# EAGLE design Pure SH (EAGLE 9.6.2)
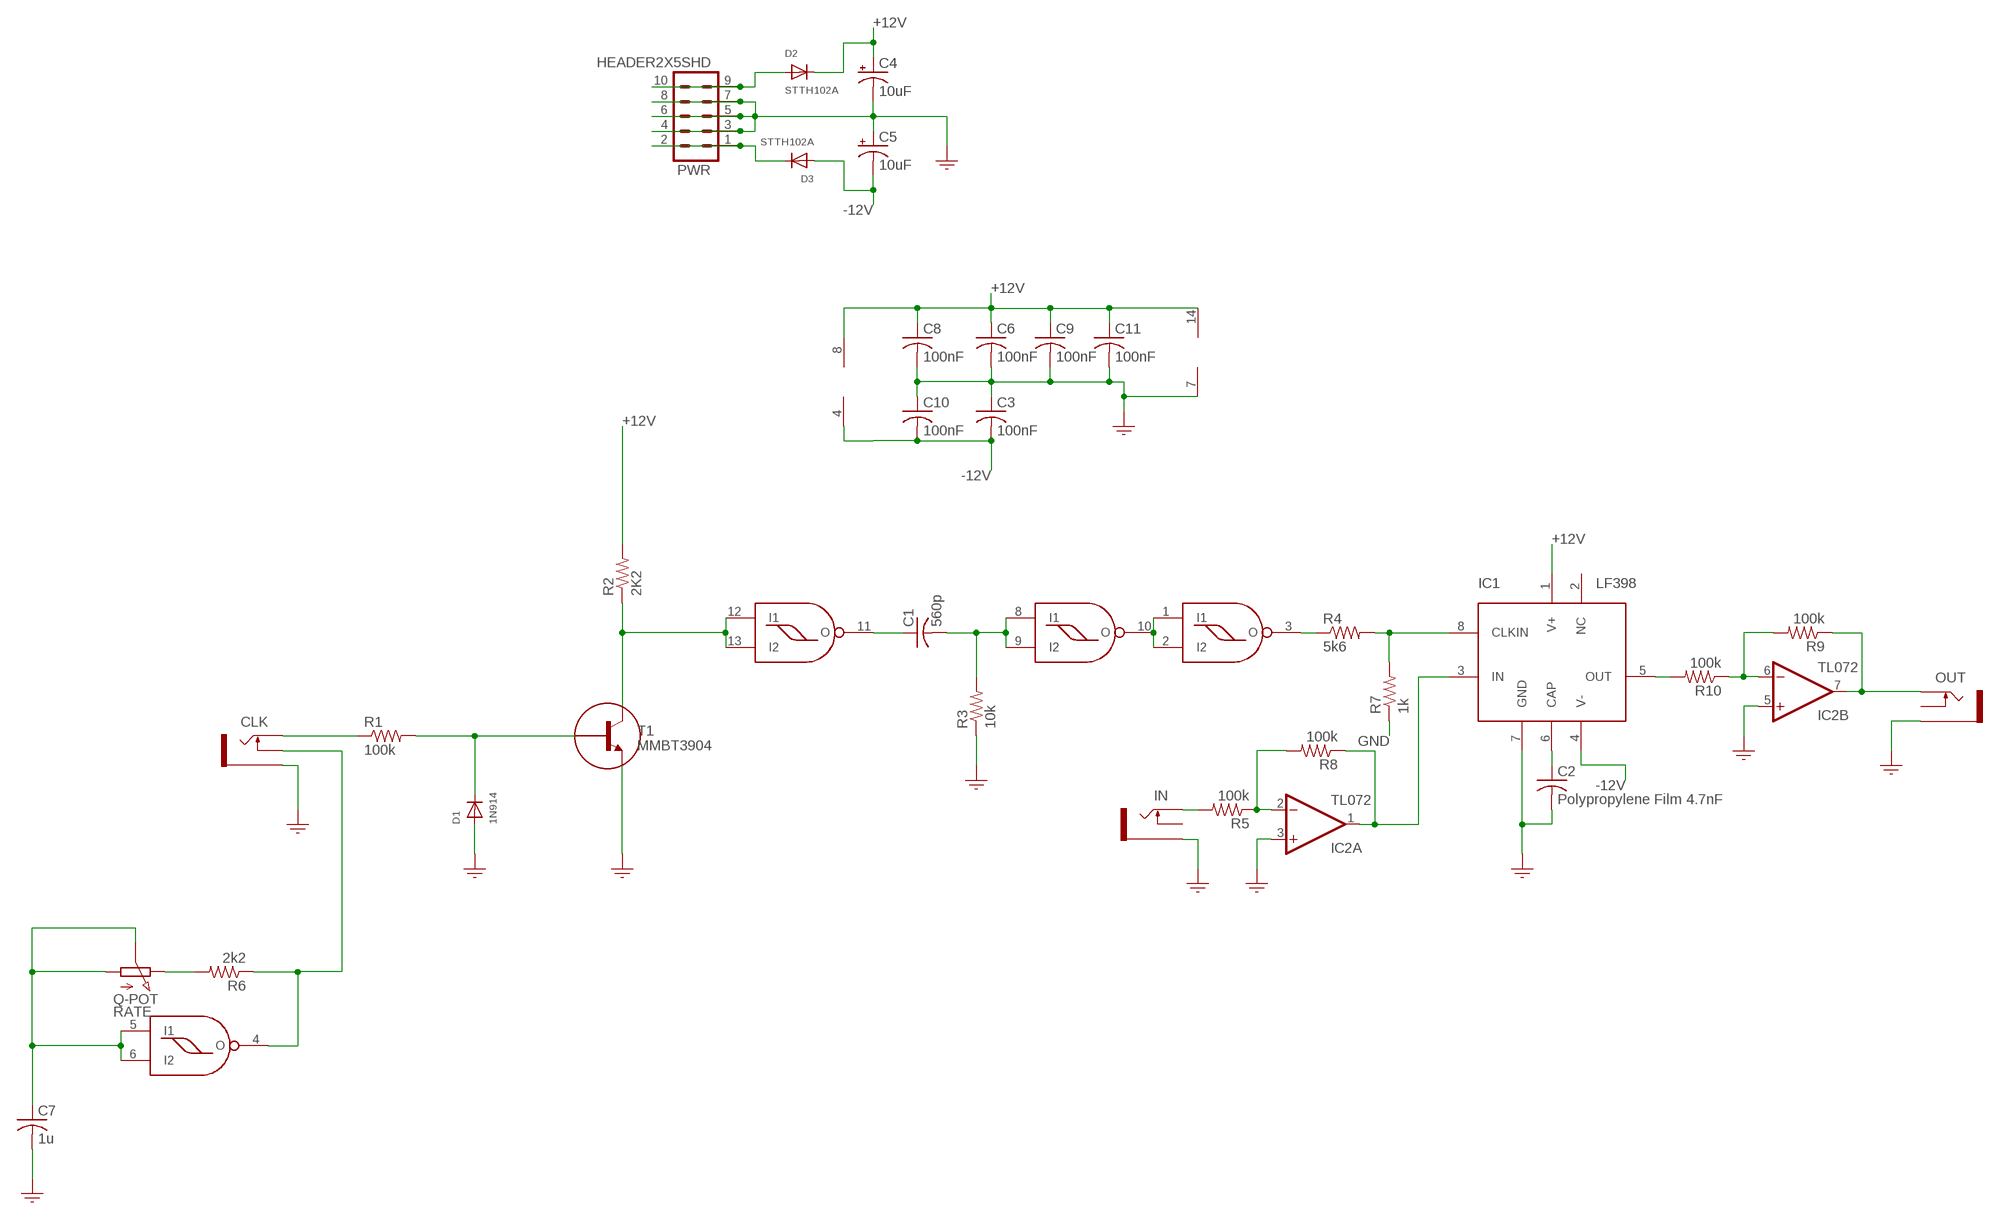
[diagram p0: schematic, sheet 1]

## Parts
C1  560p  CAPACITOR-USC0805  [C0805]
C2  Polypropylene Film 4.7nF  CAPACITOR-USC050-045X075  [C050-045X075]
C3  100nF  CAPACITOR-USC0805  [C0805]
C4  10uF  CAPACITOR_POL-US153CLV-0505  [153CLV-0505]
C5  10uF  CAPACITOR_POL-US153CLV-0505  [153CLV-0505]
C6  100nF  CAPACITOR-USC0805  [C0805]
C7  1u  CAPACITOR-USC0805  [C0805]
C8  100nF  CAPACITOR-USC0805  [C0805]
C9  100nF  CAPACITOR-USC0805  [C0805]
C10  100nF  CAPACITOR-USC0805  [C0805]
C11  100nF  CAPACITOR-USC0805  [C0805]
CLK  PJ301M-12  SOCKET_MONO_3.5MMPJ301M-12  [PJ301M-12]
D1  1N914  DIODEDO-41  [DO-41]
D2  STTH102A  DIODESMA  [SMADIODE]
D3  STTH102A  DIODESMA  [SMADIODE]
IC1  LF398  SAMPLE_HOLD_LF398  [SOIC--8]
IC2  TL072  OPAMP_DUALD  [SO08]
IC3  cd4093  SCHMITT_TRIG_QUAD  [SOIC14]
IN  PJ301M-12  SOCKET_MONO_3.5MMPJ301M-12  [PJ301M-12]
OUT  PJ301M-12  SOCKET_MONO_3.5MMPJ301M-12  [PJ301M-12]
PWR  HEADER2X5SHD  [2X5-SHROUDED]
R1  100k  RESISTOR_USR0805  [R0805]
R2  2K2  RESISTOR_USR0805  [R0805]
R3  10k  RESISTOR_USR0805  [R0805]
R4  5k6  RESISTOR_USR0805  [R0805]
R5  100k  RESISTOR_USR0805  [R0805]
R6  2k2  RESISTOR_USR0805  [R0805]
R7  1k  RESISTOR_USR0805  [R0805]
R8  100k  RESISTOR_USR0805  [R0805]
R9  100k  RESISTOR_USR0805  [R0805]
R10  100k  RESISTOR_USR0805  [R0805]
RATE  Q-POT  RESISTOR_VARIABLE9MM_POT  [POTENTIOMETER_9MM]
T1  MMBT3904  TRANSISTOR_NPNSOT23  [SOT23]

## Nets
+12V: C4.+ C6.1 C8.1 C9.1 C11.1 D2.C IC1.1(V+) IC2.8(P:V+) IC3.14(V+) R2.2
-12V: C3.2 C5.- C10.2 D3.A IC1.4(V-) IC2.4(P:V-)
GND: C2.2 C3.1 C4.- C5.+ C6.2 C7.2 C8.2 C9.2 C10.1 C11.2 CLK.GND(SLEEVE) D1.A IC1.7(GND) IC2.3(A:+IN) IC2.5(B:+IN) IC3.7(V-) IN.GND(SLEEVE) OUT.GND(SLEEVE) PWR.3 PWR.4 PWR.5 PWR.6 PWR.7 PWR.8 R3.1 R7.1 T1.2(E)
N$1: CLK.TIP R1.1
N$2: D1.C R1.2 T1.1(B)
N$3: C1.1 IC3.11(O)
N$4: IC3.12(I1) IC3.13(I2) R2.1 T1.3(C)
N$5: IC3.1(I1) IC3.2(I2) IC3.10(O)
N$6: IC1.8(CLKIN) R4.2 R7.2
N$7: C1.2 IC3.8(I1) IC3.9(I2) R3.2
N$9: IC3.3(O) R4.1
N$10: C2.1 IC1.6(CAP)
N$11: IN.TIP R5.2
N$12: IC2.2(A:-IN) R5.1 R8.2
N$13: R6.2 RATE.P$3
N$14: C7.1 IC3.5(I1) IC3.6(I2) RATE.P$1 RATE.P$2
N$15: CLK.NORM(SWITCH) IC3.4(O) R6.1
N$16: IC1.3(IN) IC2.1(A:OUT) R8.1
N$17: IC1.5(OUT) R10.2
N$18: IC2.6(B:-IN) R9.2 R10.1
N$19: IC2.7(B:OUT) OUT.TIP R9.1
N$38: D2.A PWR.9 PWR.10
N$50: D3.C PWR.1 PWR.2
Unconnected: IC1.2(NC) IN.NORM(SWITCH) OUT.NORM(SWITCH)

## Library data of the parts
C1 C3 C6-C11 = GMSN:CAPACITOR-US: Capacitor; SORT: 3
C2 = GMSN:CAPACITOR-US: Capacitor; SORT: 5
C4 C5 = GMSN:CAPACITOR_POL-US: Electro Capacitor; SORT: 3
CLK IN OUT = GMSN:SOCKET_MONO_3.5MM: 3.5 mm Jack Socket; SORT: 8
D1 = GMSN:DIODE: Diode SMADIODE - SMA Surface Mount Package 20V 1A Schottky Diode Digikey: 641-1014-6-ND DO-1N4148 - Through Hole Small Current Diode SOD-123 20V 1 A (.5mV Vf) Schottky Diode - Digikey: MBRX120TPMSCT-ND SOD-323 10V 570mA (.38mV Vf, 3ns) Schottky Diode - Digikey: ZLLS410CT-ND SOD-523 30V 30mA Schottky Diode (RB751S-40TE61) - Digikey: RB751S-40TE61CT-ND SOT23-R/W - SOT23 Package (R = Solder Paste/Reflow Ovens, W = Hand-Soldering) BAT54Film 40V 300mA - Digikey: 497-7162-1-ND; SORT: 1
D2 D3 = GMSN:DIODE: Diode SMADIODE - SMA Surface Mount Package 20V 1A Schottky Diode Digikey: 641-1014-6-ND DO-1N4148 - Through Hole Small Current Diode SOD-123 20V 1 A (.5mV Vf) Schottky Diode - Digikey: MBRX120TPMSCT-ND SOD-323 10V 570mA (.38mV Vf, 3ns) Schottky Diode - Digikey: ZLLS410CT-ND SOD-523 30V 30mA Schottky Diode (RB751S-40TE61) - Digikey: RB751S-40TE61CT-ND SOT23-R/W - SOT23 Package (R = Solder Paste/Reflow Ovens, W = Hand-Soldering) BAT54Film 40V 300mA - Digikey: 497-7162-1-ND; SORT: 3.9
IC1 = GMSN:SAMPLE_HOLD_LF398: Sample and Hold; SORT: 4
IC2 = GMSN:OPAMP_DUAL: Dual Op Amp; SORT: 4.5
IC3 = GMSN:SCHMITT_TRIG_QUAD: Quad 2-input NAND schmitt trigger; SORT: 4
PWR = GMSN:HEADER2X5: Header 5x2 Standard 10-pin dual row 0.1" header. Commonly used with AVR-ISP. Use with Spark Fun Electronics SKU: PRT-00778; SORT: 7
R1-R10 = GMSN:RESISTOR_US: Resistor; SORT: 2
RATE = GMSN:RESISTOR_VARIABLE: Pot; SORT: 8
T1 = GMSN:TRANSISTOR_NPN: Generic NPN BJT MMBT2222A - TRANS-08049 (SOT-23, 1A 40V) MPSA42 - TRANS-09116 (SOT-23, 500mA 300V) MMBT5088LT1G - TRANS-11160 (SOT-23, 50 mA 30V); SORT: 4

## Board
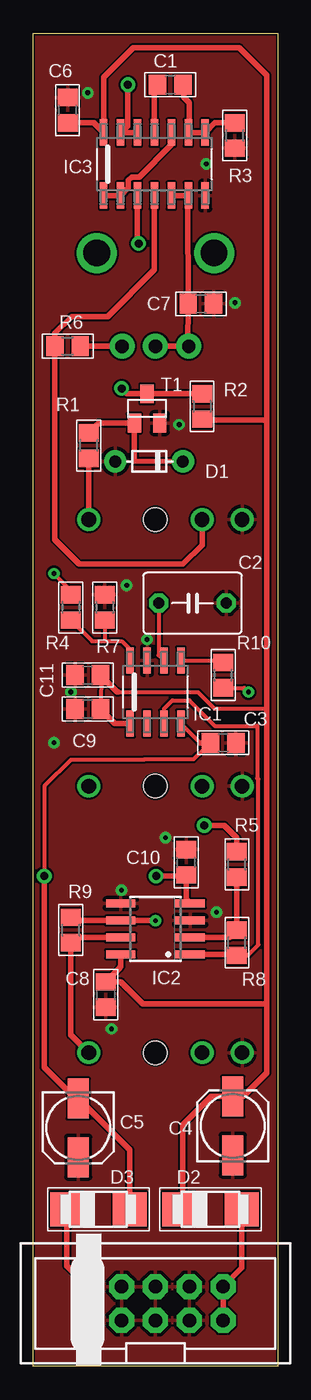
[diagram p1: board, top side]
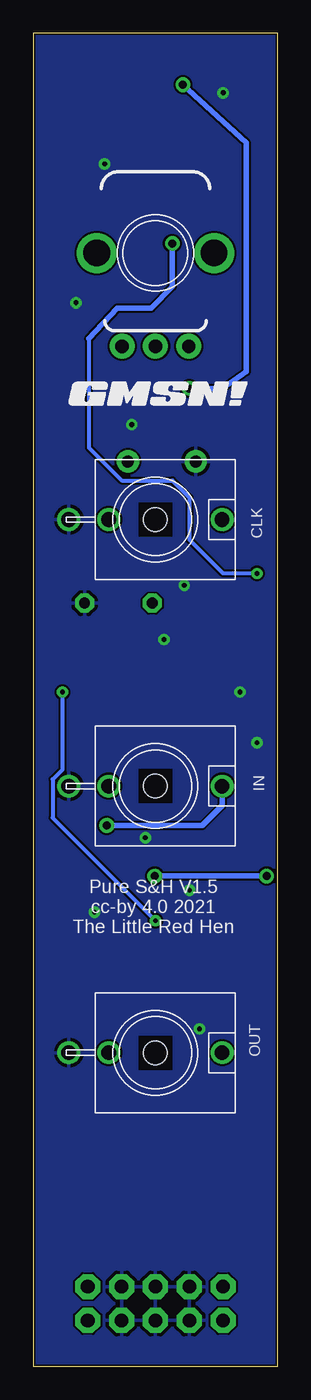
[diagram p2: board, bottom side, seen from below]

Size 18.32 x 100 mm. Coordinates in mm from the lower left corner, seen from the top.
Outline: 18.32,0 0,0 0,100 18.32,100 18.32,0
Copper layers (1*16): Top 0.035mm / dielectric 1.5mm / Bottom 0.035mm
Design rules "PCBWay": minimum track width 6mil, minimum drill 12mil, track to track 6mil, track to pad 6mil, pad to pad 6mil, via to via 6mil, smd to smd 6mil, copper to edge 6mil, drill to drill 6mil, minimum pad ring 12mil, minimum via ring 10mil, stop-mask expansion 4mil, vias tented up to drill 25mil, thermal gap 10mil

### Footprints (pad centres in the part's own frame; a part is rotated, then mirrored left to right if it is on the bottom)
C0805 = smd 1.3 x 1.5: 1 -0.95,0; 2 0.95,0
C050-045X075 = drill 0.813 octagon: 1 -2.54,0; 2 2.54,0
153CLV-0505 = smd 3 x 1.6: + 2.2,0; - -2.2,0
PJ301M-12 = drill 1.1: GND 0,-6.5; NORM 0,-3.5; TIP 0,5 | hole 1.778: 0,0
DO-41 = drill 0.9 pad 1.676: A -2.54,0; C 2.54,0
SMADIODE = smd 2.54 x 2.54: A 2.349,0; C -2.349,0
SOIC--8 = smd 1.981 x 0.559: 1 -2.362,1.905; 2 -2.362,0.635; 3 -2.362,-0.635; 4 -2.362,-1.905; 5 2.362,-1.905; 6 2.362,-0.635; 7 2.362,0.635; 8 2.362,1.905
SO08 = smd 0.6 x 2.2: 1 -1.905,-2.6; 2 -0.635,-2.6; 3 0.635,-2.6; 4 1.905,-2.6; 5 1.905,2.6; 6 0.635,2.6; 7 -0.635,2.6; 8 -1.905,2.6
SOIC14 = smd 1.981 x 0.559: 1 -2.362,3.81; 2 -2.362,2.54; 3 -2.362,1.27; 4 -2.362,0; 5 -2.362,-1.27; 6 -2.362,-2.54; 7 -2.362,-3.81; 8 2.362,-3.81; 9 2.362,-2.54; 10 2.362,-1.27; 11 2.362,0; 12 2.362,1.27; 13 2.362,2.54; 14 2.362,3.81
2X5-SHROUDED = drill 1.016 pad 1.88 octagon: 1 -1.27,5.08; 2 1.27,5.08; 3 -1.27,2.54; 4 1.27,2.54; 5 -1.27,0; 6 1.27,0; 7 -1.27,-2.54; 8 1.27,-2.54; 9 -1.27,-5.08; 10 1.27,-5.08
R0805 = smd 1.3 x 1.5: 1 -0.95,0; 2 0.95,0
POTENTIOMETER_9MM = drill 1 pad 1.88: P$1 -2.5,-7; P$2 0,-7; P$3 2.5,-7 | drill 2 pad 2.68: P$4 -4.4,0; P$5 4.4,0
SOT23 = smd 1 x 1.4: 1 -0.95,-1.1; 2 0.95,-1.1; 3 0,1.1

### Placement (x,y rotation side)
C1  10.27,96.14 0 top
C2  11.94,57.25 0 top
C3  14.24,46.77 180 top
C4  14.95,18.04 90 top
C5  3.37,17.88 270 top
C6  2.57,94.24 90 top
C7  12.57,79.71 0 top
C8  5.43,27.88 270 top
C9  4.08,49.31 180 top
C10  11.46,37.8 270 top
C11  4.08,51.85 180 top
CLK  9.16,63.52 270 bottom
D1  8.68,67.88 0 top
D2  13.29,11.77 0 top
D3  4.87,11.77 0 top
IC1  9.16,50.58 90 top
IC2  9.16,32.8 90 top
IC3  9.08,90.19 90 top
IN  9.16,43.52 270 bottom
OUT  9.16,23.52 270 bottom
PWR  9.16,4.7 90 top
R1  4.16,69.07 90 top
R2  12.65,72.01 270 top
R3  15.11,92.33 90 top
R4  2.81,56.93 270 top
R5  15.27,37.64 90 top
R6  2.57,76.54 0 top
R7  5.35,56.93 270 top
R8  15.27,31.77 90 top
R9  2.81,32.72 90 top
R10  14.24,51.85 90 top
RATE  9.16,83.52 0 bottom
T1  8.53,71.85 0 top
U$3  [GMSN!_LOGO]  8.68,72.88 0 bottom

### Tracks (layer width: path | path; a pad name or v marks a point on that pad's centre or on a via)
+12V
  Top 0.305: C11.1 5.08,51.21 C9.1 | 17.49,49.31 13.61,49.31 12.34,50.58 6.35,50.58
  Top 0.406: D2.C 11.22,11.8 11.22,18.12 13.34,20.24 C4.+ 15.73,20.24 17.49,22 17.49,26.77 17.49,27.24 | 17.49,27.24 17.49,49.31 17.49,70.82 | 17.49,27.24 17.41,27.16 8.21,27.16 6.54,28.83 C8.1 6.48,29.88 6.48,29.93 6.56,30.01 IC2.8 | R2.2 12.65,70.98 17.34,70.98 17.49,70.82 | 17.49,70.82 17.49,96.86 15.43,98.92 7.49,98.92 5.27,96.7 IC3.14 4.54,93.29 C6.1 | C11.1 6.3,50.58 6.35,50.58 | C9.1 6.12,48.22 IC1.1
-12V  (via drill 0.6)
  Top 0.305: C3.2 12,45.53 8.33,45.53 8.3,45.5 2.81,45.5 0.83,43.52 v0.83,36.77 | 12.51,46.77 IC1.4
  Top 0.406: D3.A 7.22,16.22 C5.- 3.15,20.08 0.83,22.4 v0.83,36.77 | C3.2 12.51,46.77 | v9.21,36.77 11.43,36.77 C10.2 11.46,35 IC2.4
  Bottom 0.406: v0.83,36.77 v9.21,36.77
GND  (via drill 0.35)
  other vias: 1.54,46.77 2.81,50.58 8.53,54.52 9.92,39.66 13.73,34.07 6.62,35.72 5.86,25.31 7,58.58 10.94,70.65 15.13,79.79 4.08,95.54 12.97,90.2
  pour Bottom: 18.32,100 0,100 0,0 18.32,0
  pour Top: 18.32,100 0,100 0,0 18.32,0
N$1
  Top 0.406: R1.1 CLK.TIP
N$2
  Top 0.406: R1.2 4.89,70.75 T1.1 7.57,67.92 D1.C
N$3
  Top 0.406: IC3.11 9.08,95.9 C1.1
N$4  (via drill 0.6)
  Top 0.406: R2.1 8.53,72.96 | 8.53,72.96 T1.3 | 8.53,72.96 7.02,72.96 v6.62,73.36 | v7.1,96.14 7.1,93.76 7.1,93.03 6.62,92.55 | IC3.13 6.62,92.55 | 6.62,92.55 IC3.12
  Bottom 0.406: v6.62,73.36 4.16,73.36 2.33,74.63 2.33,91.78 v7.1,96.14
N$5
  Top 0.406: IC3.1 IC3.2 7.12,88.41 7.12,88.98 7.36,89.22 7.94,89.22 10.35,91.64 IC3.10
N$6
  Top 0.305: R4.2 4.4,54.39 5.35,54.39 | 5.35,54.39 6.62,54.39 7.26,53.75 IC1.8 | R7.2 5.35,54.39
N$7
  Top 0.406: C1.2 11.27,95.22 11.7,94.79 11.7,92.63 IC3.9 IC3.8 13.62,93.28 R3.2
N$9  (via drill 0.35, 0.6)
  Top 0.305: R4.1 2.81,58.2 v1.54,59.47
  Top 0.406: v7.89,84.23 7.81,84.31 IC3.3
  Bottom 0.305: 14.16,77.09 14.16,68.92 11.7,66.45 7.89,66.45 6.62,65.19 6.62,62.01 4.08,59.47 v1.54,59.47
  Bottom 0.406: v7.89,84.23 7.89,80.98 9.48,79.39 12.02,79.39 14.16,77.09
N$10
  Top 0.305: C2.1 9.4,53.34 IC1.6
N$11  (via drill 0.6)
  Top 0.406: v12.81,40.58 14.32,40.58 15.27,39.63 R5.2
  Bottom 0.406: IN.TIP 4.16,42.09 5.67,40.58 v12.81,40.58
N$12
  Top 0.406: R5.1 R8.2 14.72,32.17 IC2.2
N$13
  Top 0.406: R6.2 6.64,76.54 RATE.P$3
N$14
  Top 0.406: RATE.P$2 RATE.P$1 11.57,76.61 C7.1 11.57,87.07 11.57,87.78 IC3.6 IC3.5
N$15
  Top 0.406: CLK.NORM 12.66,61.62 11.22,60.18 3.45,60.18 1.62,62.01 1.62,72.33 R6.1 1.62,77.49 2.89,78.76 5.59,78.76 9.08,82.25 IC3.4
N$16
  Top 0.305: R8.1 15.51,30.82 16.07,30.82 16.87,31.62 16.87,44.02 16.78,44.11 16.78,48.04 13.61,48.04 11.7,49.94 10.43,49.94 9.79,49.31 IC1.3
  Top 0.406: IC2.1 15.43,30.89 15.51,30.82
N$17
  Top 0.305: IC1.5 14.1,52.94 R10.2
N$18  (via drill 0.35)
  Top 0.305: R10.1 15.82,50.9 v16.14,50.58
  Top 0.406: R9.2 3.05,33.44 IC2.6 v9.16,33.44
  Bottom 0.305: v16.14,50.58 16.14,44.75 16.87,44.02 16.87,41.14 v9.16,33.44
N$19
  Top 0.406: OUT.TIP 2.81,24.87 R9.1 3.2,32.17 IC2.7
N$38
  Top 0.406: PWR.9 PWR.10 15.64,7.37 D2.A
N$50
  Top 0.406: PWR.1 PWR.2 2.52,7.53 D3.C

### Text on the board
bPlace: Pure S&H V1.5 / cc-by 4.0 2021 / The Little Red Hen